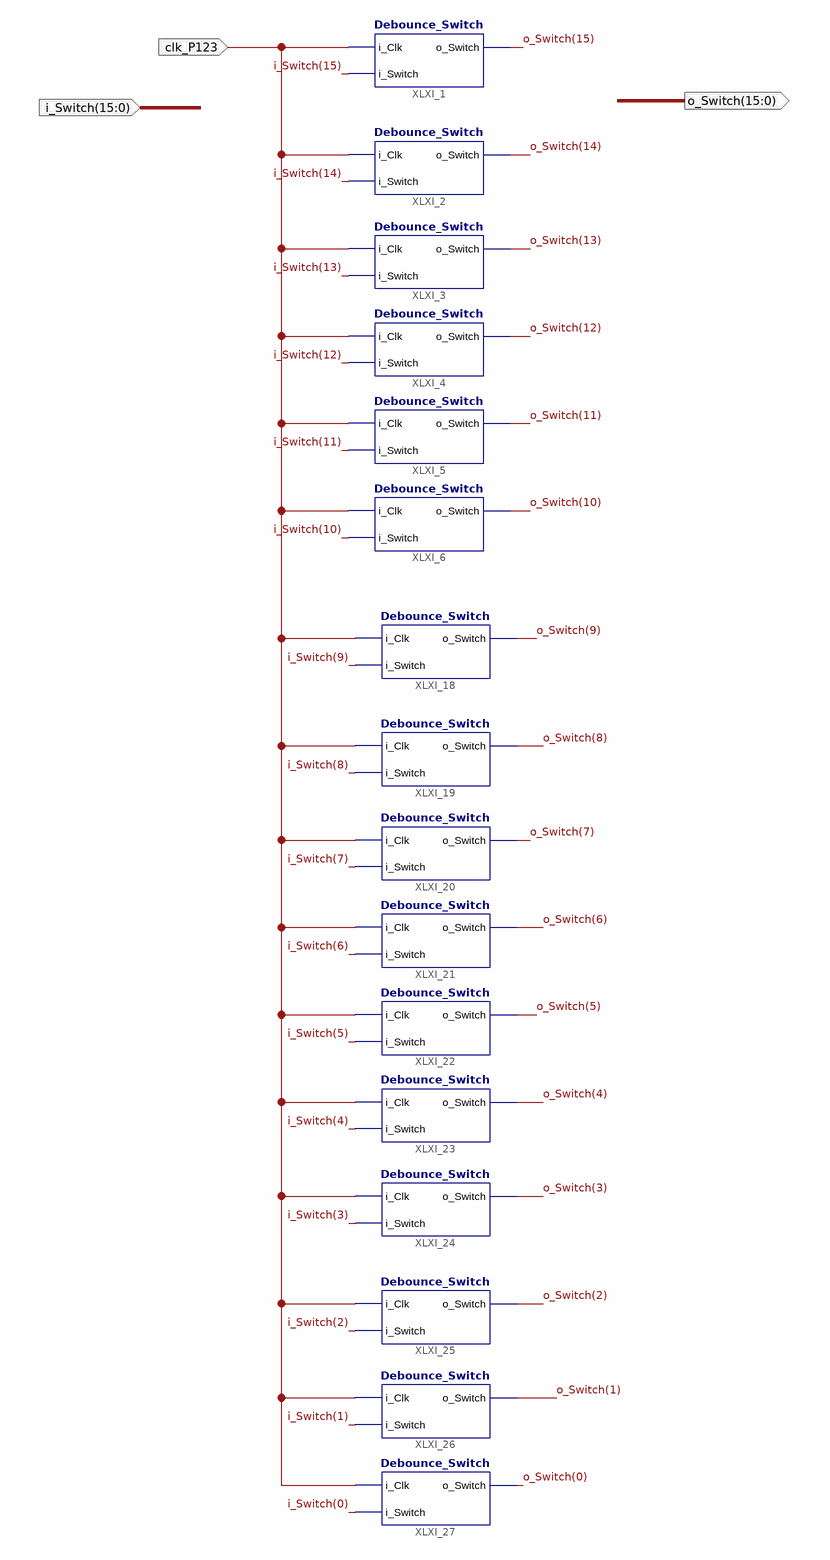
[diagram p0: schematic sheet 1]
// Xilinx ISE schematic debounceSwitch16input.sch (spartan6) as structural Verilog: 16 symbols, 3 ports
module debounceSwitch16input (
  input  clk_P123,
  input  [15:0] i_Switch,
  output [15:0] o_Switch
);

  Debounce_Switch XLXI_1 (.i_Clk(clk_P123), .i_Switch(i_Switch[15]), .o_Switch(o_Switch[15]));
  Debounce_Switch XLXI_2 (.i_Clk(clk_P123), .i_Switch(i_Switch[14]), .o_Switch(o_Switch[14]));
  Debounce_Switch XLXI_3 (.i_Clk(clk_P123), .i_Switch(i_Switch[13]), .o_Switch(o_Switch[13]));
  Debounce_Switch XLXI_4 (.i_Clk(clk_P123), .i_Switch(i_Switch[12]), .o_Switch(o_Switch[12]));
  Debounce_Switch XLXI_5 (.i_Clk(clk_P123), .i_Switch(i_Switch[11]), .o_Switch(o_Switch[11]));
  Debounce_Switch XLXI_6 (.i_Clk(clk_P123), .i_Switch(i_Switch[10]), .o_Switch(o_Switch[10]));
  Debounce_Switch XLXI_18 (.i_Clk(clk_P123), .i_Switch(i_Switch[9]), .o_Switch(o_Switch[9]));
  Debounce_Switch XLXI_19 (.i_Clk(clk_P123), .i_Switch(i_Switch[8]), .o_Switch(o_Switch[8]));
  Debounce_Switch XLXI_20 (.i_Clk(clk_P123), .i_Switch(i_Switch[7]), .o_Switch(o_Switch[7]));
  Debounce_Switch XLXI_21 (.i_Clk(clk_P123), .i_Switch(i_Switch[6]), .o_Switch(o_Switch[6]));
  Debounce_Switch XLXI_22 (.i_Clk(clk_P123), .i_Switch(i_Switch[5]), .o_Switch(o_Switch[5]));
  Debounce_Switch XLXI_23 (.i_Clk(clk_P123), .i_Switch(i_Switch[4]), .o_Switch(o_Switch[4]));
  Debounce_Switch XLXI_24 (.i_Clk(clk_P123), .i_Switch(i_Switch[3]), .o_Switch(o_Switch[3]));
  Debounce_Switch XLXI_25 (.i_Clk(clk_P123), .i_Switch(i_Switch[2]), .o_Switch(o_Switch[2]));
  Debounce_Switch XLXI_26 (.i_Clk(clk_P123), .i_Switch(i_Switch[1]), .o_Switch(o_Switch[1]));
  Debounce_Switch XLXI_27 (.i_Clk(clk_P123), .i_Switch(i_Switch[0]), .o_Switch(o_Switch[0]));
endmodule
